# EasyEDA Pro project ProPrj_RGB_AddOn.epro, board PCB1
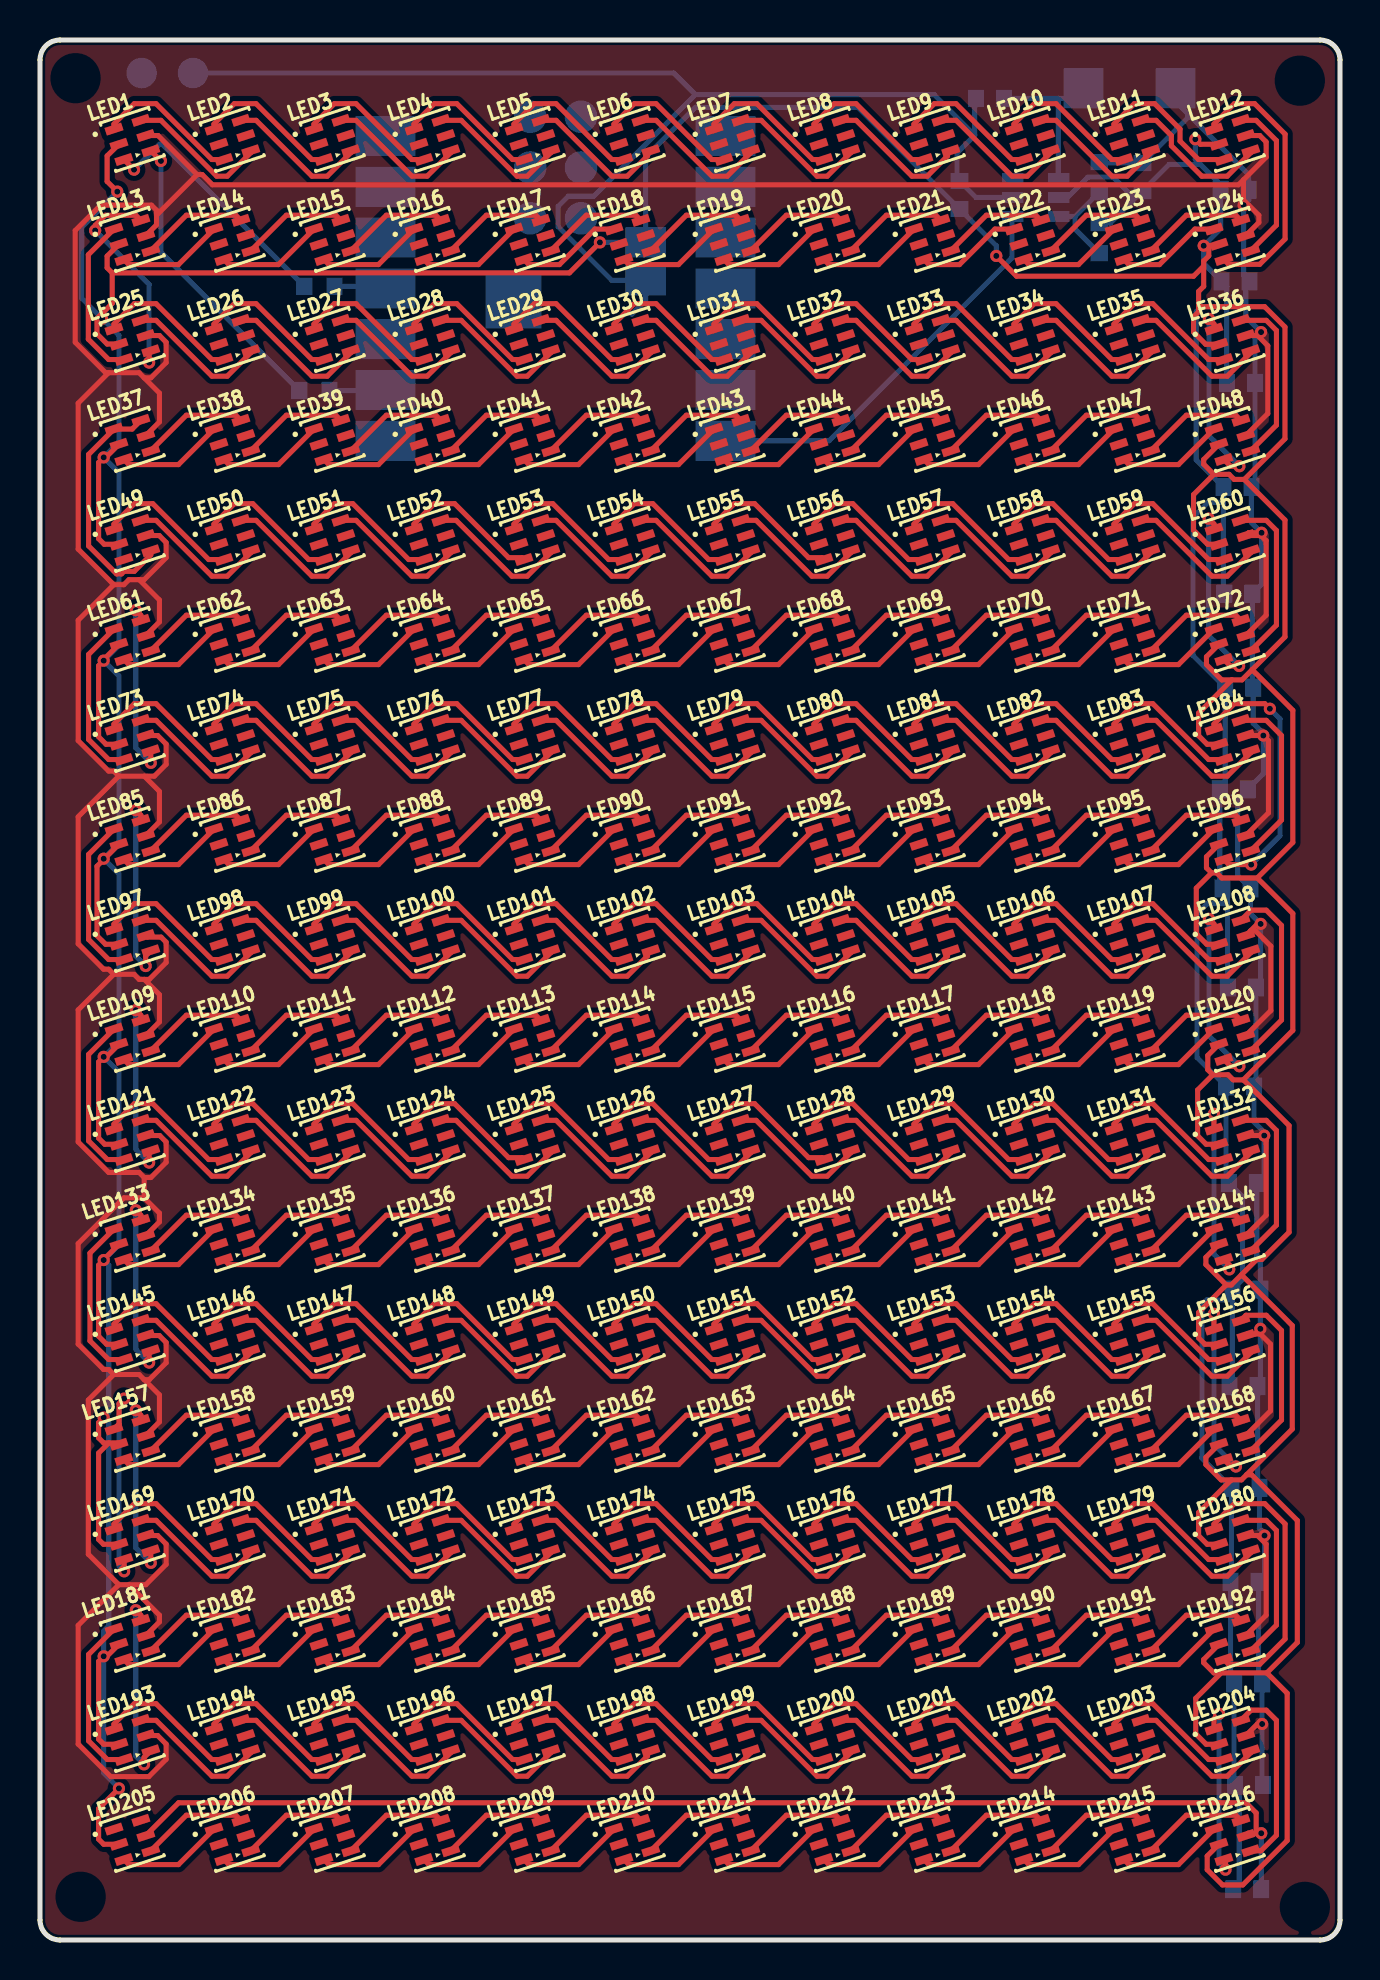
[diagram p2: board, top side]
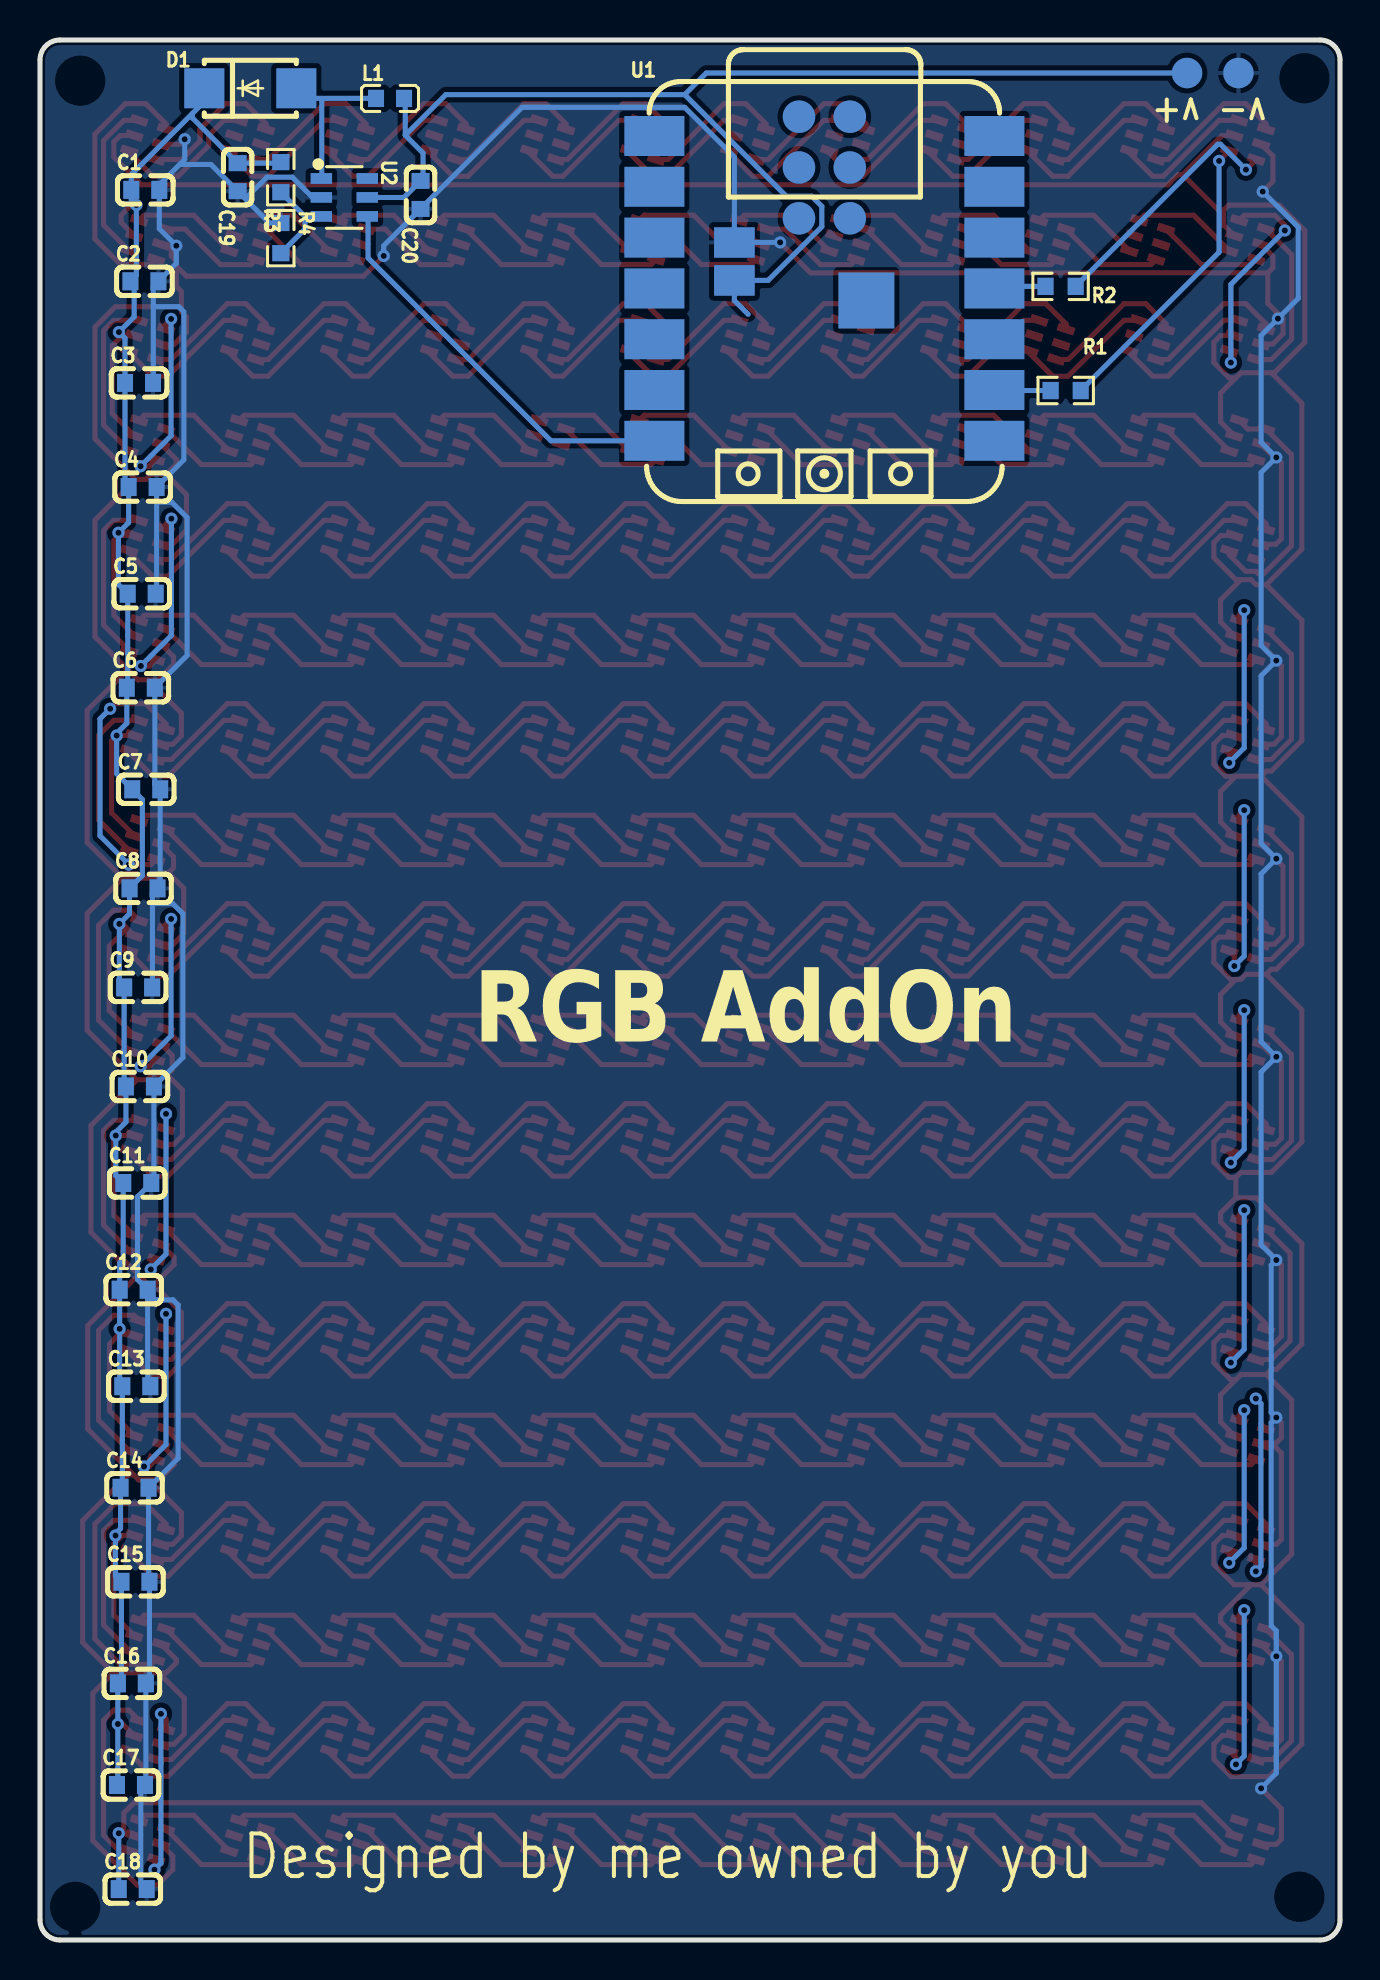
[diagram p3: board, bottom side, seen from below]

Outline 65 x 95 mm; copper layers: Top Layer, Bottom Layer. Coordinates in mm from the lower left corner of the outline.
Outline path: 0,94 0,1 arc(0.29,0.29) 1,0 64,0 arc(64.71,0.29) 65,1 65,94 arc(64.71,94.71) 64,95 1,95 arc(0.29,94.71) 0,94
Stack: Top Layer 0.035mm / Dielectric1 0.71mm FR4 er 4.5 / Bottom Layer 0.035mm

## Design rules (mm)
template: JLCPCB Capability(Two Layers Board)
spacing copperThickness1oz (default): track to track 0.102, other pairs 0.152 to 0.3
spacing copperThickness2oz: track to track 0.203, other pairs 0.152 to 0.3
track width copperThickness1oz (default): min 0.127, default 0.254, max 2.54
track width copperThickness2oz: min 0.203, default 0.254, max 2.54
differential pair differentialPair (default): width min 0.127, default 0.254, max 2.54; gap min 0.152, default 0.152
via viaSize (default): diameter min 0.5, default 0.61, max 10; hole min 0.3, default 0.305, max 6.3

## Placement (name value [footprint] x y rotation side)
C1  100nF  [C0603]  59.74 87.51 180 bottom
C2  100nF  [C0603]  59.78 82.93 180 bottom
C3  100nF  [C0603]  60.05 77.85 180 bottom
C4  100nF  [C0603]  59.87 72.65 180 bottom
C5  100nF  [C0603]  59.91 67.31 180 bottom
C6  100nF  [C0603]  59.96 62.61 180 bottom
C7  100nF  [C0603]  59.69 57.53 180 bottom
C8  100nF  [C0603]  59.82 52.58 180 bottom
C9  100nF  [C0603]  60.09 47.63 180 bottom
C10  100nF  [C0603]  60 42.68 180 bottom
C11  100nF  [C0603]  60.14 37.85 180 bottom
C12  100nF  [C0603]  60.32 32.52 180 bottom
C13  100nF  [C0603]  60.18 27.69 180 bottom
C14  100nF  [C0603]  60.27 22.61 180 bottom
C15  100nF  [C0603]  60.23 17.91 180 bottom
C16  100nF  [C0603]  60.41 12.83 180 bottom
C17  100nF  [C0603]  60.45 7.75 180 bottom
C18  100nF  [C0603]  60.36 2.54 180 bottom
C19  220uf  [C0603]  55.12 88.14 90 bottom
C20  22uF  [C0603]  45.97 87.25 90 bottom
D1  SS24  [DO-214AC_L4.3-W2.7-LS5.2-RD]  54.48 92.59 180 bottom
L1  4.7uH  [L0603]  47.5 92.08 180 bottom
LED1  SK9822-EC20  [LED-SMD_6P-L2.0-W2.0-P0.80-TL]  4.62 90 18 top
LED2  SK9822-EC20  [LED-SMD_6P-L2.0-W2.0-P0.80-TL]  9.62 90 18 top
LED3  SK9822-EC20  [LED-SMD_6P-L2.0-W2.0-P0.80-TL]  14.62 90 18 top
LED4  SK9822-EC20  [LED-SMD_6P-L2.0-W2.0-P0.80-TL]  19.62 90 18 top
LED5  SK9822-EC20  [LED-SMD_6P-L2.0-W2.0-P0.80-TL]  24.62 90 18 top
LED6  SK9822-EC20  [LED-SMD_6P-L2.0-W2.0-P0.80-TL]  29.62 90 18 top
LED7  SK9822-EC20  [LED-SMD_6P-L2.0-W2.0-P0.80-TL]  34.62 90 18 top
LED8  SK9822-EC20  [LED-SMD_6P-L2.0-W2.0-P0.80-TL]  39.62 90 18 top
LED9  SK9822-EC20  [LED-SMD_6P-L2.0-W2.0-P0.80-TL]  44.62 90 18 top
LED10  SK9822-EC20  [LED-SMD_6P-L2.0-W2.0-P0.80-TL]  49.62 90 18 top
LED11  SK9822-EC20  [LED-SMD_6P-L2.0-W2.0-P0.80-TL]  54.62 90 18 top
LED12  SK9822-EC20  [LED-SMD_6P-L2.0-W2.0-P0.80-TL]  59.62 90 18 top
LED13  SK9822-EC20  [LED-SMD_6P-L2.0-W2.0-P0.80-TL]  4.62 85 18 top
LED14  SK9822-EC20  [LED-SMD_6P-L2.0-W2.0-P0.80-TL]  9.62 85 18 top
LED15  SK9822-EC20  [LED-SMD_6P-L2.0-W2.0-P0.80-TL]  14.62 85 18 top
LED16  SK9822-EC20  [LED-SMD_6P-L2.0-W2.0-P0.80-TL]  19.62 85 18 top
LED17  SK9822-EC20  [LED-SMD_6P-L2.0-W2.0-P0.80-TL]  24.62 85 18 top
LED18  SK9822-EC20  [LED-SMD_6P-L2.0-W2.0-P0.80-TL]  29.62 85 18 top
LED19  SK9822-EC20  [LED-SMD_6P-L2.0-W2.0-P0.80-TL]  34.62 85 18 top
LED20  SK9822-EC20  [LED-SMD_6P-L2.0-W2.0-P0.80-TL]  39.62 85 18 top
LED21  SK9822-EC20  [LED-SMD_6P-L2.0-W2.0-P0.80-TL]  44.62 85 18 top
LED22  SK9822-EC20  [LED-SMD_6P-L2.0-W2.0-P0.80-TL]  49.62 85 18 top
LED23  SK9822-EC20  [LED-SMD_6P-L2.0-W2.0-P0.80-TL]  54.62 85 18 top
LED24  SK9822-EC20  [LED-SMD_6P-L2.0-W2.0-P0.80-TL]  59.62 85 18 top
LED25  SK9822-EC20  [LED-SMD_6P-L2.0-W2.0-P0.80-TL]  4.62 80 18 top
LED26  SK9822-EC20  [LED-SMD_6P-L2.0-W2.0-P0.80-TL]  9.62 80 18 top
LED27  SK9822-EC20  [LED-SMD_6P-L2.0-W2.0-P0.80-TL]  14.62 80 18 top
LED28  SK9822-EC20  [LED-SMD_6P-L2.0-W2.0-P0.80-TL]  19.62 80 18 top
LED29  SK9822-EC20  [LED-SMD_6P-L2.0-W2.0-P0.80-TL]  24.62 80 18 top
LED30  SK9822-EC20  [LED-SMD_6P-L2.0-W2.0-P0.80-TL]  29.62 80 18 top
LED31  SK9822-EC20  [LED-SMD_6P-L2.0-W2.0-P0.80-TL]  34.62 80 18 top
LED32  SK9822-EC20  [LED-SMD_6P-L2.0-W2.0-P0.80-TL]  39.62 80 18 top
LED33  SK9822-EC20  [LED-SMD_6P-L2.0-W2.0-P0.80-TL]  44.62 80 18 top
LED34  SK9822-EC20  [LED-SMD_6P-L2.0-W2.0-P0.80-TL]  49.62 80 18 top
LED35  SK9822-EC20  [LED-SMD_6P-L2.0-W2.0-P0.80-TL]  54.62 80 18 top
LED36  SK9822-EC20  [LED-SMD_6P-L2.0-W2.0-P0.80-TL]  59.62 80 18 top
LED37  SK9822-EC20  [LED-SMD_6P-L2.0-W2.0-P0.80-TL]  4.62 75 18 top
LED38  SK9822-EC20  [LED-SMD_6P-L2.0-W2.0-P0.80-TL]  9.62 75 18 top
LED39  SK9822-EC20  [LED-SMD_6P-L2.0-W2.0-P0.80-TL]  14.62 75 18 top
LED40  SK9822-EC20  [LED-SMD_6P-L2.0-W2.0-P0.80-TL]  19.62 75 18 top
LED41  SK9822-EC20  [LED-SMD_6P-L2.0-W2.0-P0.80-TL]  24.62 75 18 top
LED42  SK9822-EC20  [LED-SMD_6P-L2.0-W2.0-P0.80-TL]  29.62 75 18 top
LED43  SK9822-EC20  [LED-SMD_6P-L2.0-W2.0-P0.80-TL]  34.62 75 18 top
LED44  SK9822-EC20  [LED-SMD_6P-L2.0-W2.0-P0.80-TL]  39.62 75 18 top
LED45  SK9822-EC20  [LED-SMD_6P-L2.0-W2.0-P0.80-TL]  44.62 75 18 top
LED46  SK9822-EC20  [LED-SMD_6P-L2.0-W2.0-P0.80-TL]  49.62 75 18 top
LED47  SK9822-EC20  [LED-SMD_6P-L2.0-W2.0-P0.80-TL]  54.62 75 18 top
LED48  SK9822-EC20  [LED-SMD_6P-L2.0-W2.0-P0.80-TL]  59.62 75 18 top
LED49  SK9822-EC20  [LED-SMD_6P-L2.0-W2.0-P0.80-TL]  4.62 70 18 top
LED50  SK9822-EC20  [LED-SMD_6P-L2.0-W2.0-P0.80-TL]  9.62 70 18 top
LED51  SK9822-EC20  [LED-SMD_6P-L2.0-W2.0-P0.80-TL]  14.62 70 18 top
LED52  SK9822-EC20  [LED-SMD_6P-L2.0-W2.0-P0.80-TL]  19.62 70 18 top
LED53  SK9822-EC20  [LED-SMD_6P-L2.0-W2.0-P0.80-TL]  24.62 70 18 top
LED54  SK9822-EC20  [LED-SMD_6P-L2.0-W2.0-P0.80-TL]  29.62 70 18 top
LED55  SK9822-EC20  [LED-SMD_6P-L2.0-W2.0-P0.80-TL]  34.62 70 18 top
LED56  SK9822-EC20  [LED-SMD_6P-L2.0-W2.0-P0.80-TL]  39.62 70 18 top
LED57  SK9822-EC20  [LED-SMD_6P-L2.0-W2.0-P0.80-TL]  44.62 70 18 top
LED58  SK9822-EC20  [LED-SMD_6P-L2.0-W2.0-P0.80-TL]  49.62 70 18 top
LED59  SK9822-EC20  [LED-SMD_6P-L2.0-W2.0-P0.80-TL]  54.62 70 18 top
LED60  SK9822-EC20  [LED-SMD_6P-L2.0-W2.0-P0.80-TL]  59.62 70 18 top
LED61  SK9822-EC20  [LED-SMD_6P-L2.0-W2.0-P0.80-TL]  4.62 65 18 top
LED62  SK9822-EC20  [LED-SMD_6P-L2.0-W2.0-P0.80-TL]  9.62 65 18 top
LED63  SK9822-EC20  [LED-SMD_6P-L2.0-W2.0-P0.80-TL]  14.62 65 18 top
LED64  SK9822-EC20  [LED-SMD_6P-L2.0-W2.0-P0.80-TL]  19.62 65 18 top
LED65  SK9822-EC20  [LED-SMD_6P-L2.0-W2.0-P0.80-TL]  24.62 65 18 top
LED66  SK9822-EC20  [LED-SMD_6P-L2.0-W2.0-P0.80-TL]  29.62 65 18 top
LED67  SK9822-EC20  [LED-SMD_6P-L2.0-W2.0-P0.80-TL]  34.62 65 18 top
LED68  SK9822-EC20  [LED-SMD_6P-L2.0-W2.0-P0.80-TL]  39.62 65 18 top
LED69  SK9822-EC20  [LED-SMD_6P-L2.0-W2.0-P0.80-TL]  44.62 65 18 top
LED70  SK9822-EC20  [LED-SMD_6P-L2.0-W2.0-P0.80-TL]  49.62 65 18 top
LED71  SK9822-EC20  [LED-SMD_6P-L2.0-W2.0-P0.80-TL]  54.62 65 18 top
LED72  SK9822-EC20  [LED-SMD_6P-L2.0-W2.0-P0.80-TL]  59.62 65 18 top
LED73  SK9822-EC20  [LED-SMD_6P-L2.0-W2.0-P0.80-TL]  4.62 60 18 top
LED74  SK9822-EC20  [LED-SMD_6P-L2.0-W2.0-P0.80-TL]  9.62 60 18 top
LED75  SK9822-EC20  [LED-SMD_6P-L2.0-W2.0-P0.80-TL]  14.62 60 18 top
LED76  SK9822-EC20  [LED-SMD_6P-L2.0-W2.0-P0.80-TL]  19.62 60 18 top
LED77  SK9822-EC20  [LED-SMD_6P-L2.0-W2.0-P0.80-TL]  24.62 60 18 top
LED78  SK9822-EC20  [LED-SMD_6P-L2.0-W2.0-P0.80-TL]  29.62 60 18 top
LED79  SK9822-EC20  [LED-SMD_6P-L2.0-W2.0-P0.80-TL]  34.62 60 18 top
LED80  SK9822-EC20  [LED-SMD_6P-L2.0-W2.0-P0.80-TL]  39.62 60 18 top
LED81  SK9822-EC20  [LED-SMD_6P-L2.0-W2.0-P0.80-TL]  44.62 60 18 top
LED82  SK9822-EC20  [LED-SMD_6P-L2.0-W2.0-P0.80-TL]  49.62 60 18 top
LED83  SK9822-EC20  [LED-SMD_6P-L2.0-W2.0-P0.80-TL]  54.62 60 18 top
LED84  SK9822-EC20  [LED-SMD_6P-L2.0-W2.0-P0.80-TL]  59.62 60 18 top
LED85  SK9822-EC20  [LED-SMD_6P-L2.0-W2.0-P0.80-TL]  4.62 55 18 top
LED86  SK9822-EC20  [LED-SMD_6P-L2.0-W2.0-P0.80-TL]  9.62 55 18 top
LED87  SK9822-EC20  [LED-SMD_6P-L2.0-W2.0-P0.80-TL]  14.62 55 18 top
LED88  SK9822-EC20  [LED-SMD_6P-L2.0-W2.0-P0.80-TL]  19.62 55 18 top
LED89  SK9822-EC20  [LED-SMD_6P-L2.0-W2.0-P0.80-TL]  24.62 55 18 top
LED90  SK9822-EC20  [LED-SMD_6P-L2.0-W2.0-P0.80-TL]  29.62 55 18 top
LED91  SK9822-EC20  [LED-SMD_6P-L2.0-W2.0-P0.80-TL]  34.62 55 18 top
LED92  SK9822-EC20  [LED-SMD_6P-L2.0-W2.0-P0.80-TL]  39.62 55 18 top
LED93  SK9822-EC20  [LED-SMD_6P-L2.0-W2.0-P0.80-TL]  44.62 55 18 top
LED94  SK9822-EC20  [LED-SMD_6P-L2.0-W2.0-P0.80-TL]  49.62 55 18 top
LED95  SK9822-EC20  [LED-SMD_6P-L2.0-W2.0-P0.80-TL]  54.62 55 18 top
LED96  SK9822-EC20  [LED-SMD_6P-L2.0-W2.0-P0.80-TL]  59.62 55 18 top
LED97  SK9822-EC20  [LED-SMD_6P-L2.0-W2.0-P0.80-TL]  4.62 50 18 top
LED98  SK9822-EC20  [LED-SMD_6P-L2.0-W2.0-P0.80-TL]  9.62 50 18 top
LED99  SK9822-EC20  [LED-SMD_6P-L2.0-W2.0-P0.80-TL]  14.62 50 18 top
LED100  SK9822-EC20  [LED-SMD_6P-L2.0-W2.0-P0.80-TL]  19.62 50 18 top
LED101  SK9822-EC20  [LED-SMD_6P-L2.0-W2.0-P0.80-TL]  24.62 50 18 top
LED102  SK9822-EC20  [LED-SMD_6P-L2.0-W2.0-P0.80-TL]  29.62 50 18 top
LED103  SK9822-EC20  [LED-SMD_6P-L2.0-W2.0-P0.80-TL]  34.62 50 18 top
LED104  SK9822-EC20  [LED-SMD_6P-L2.0-W2.0-P0.80-TL]  39.62 50 18 top
LED105  SK9822-EC20  [LED-SMD_6P-L2.0-W2.0-P0.80-TL]  44.62 50 18 top
LED106  SK9822-EC20  [LED-SMD_6P-L2.0-W2.0-P0.80-TL]  49.62 50 18 top
LED107  SK9822-EC20  [LED-SMD_6P-L2.0-W2.0-P0.80-TL]  54.62 50 18 top
LED108  SK9822-EC20  [LED-SMD_6P-L2.0-W2.0-P0.80-TL]  59.62 50 18 top
LED109  SK9822-EC20  [LED-SMD_6P-L2.0-W2.0-P0.80-TL]  4.62 45 18 top
LED110  SK9822-EC20  [LED-SMD_6P-L2.0-W2.0-P0.80-TL]  9.62 45 18 top
LED111  SK9822-EC20  [LED-SMD_6P-L2.0-W2.0-P0.80-TL]  14.62 45 18 top
LED112  SK9822-EC20  [LED-SMD_6P-L2.0-W2.0-P0.80-TL]  19.62 45 18 top
LED113  SK9822-EC20  [LED-SMD_6P-L2.0-W2.0-P0.80-TL]  24.62 45 18 top
LED114  SK9822-EC20  [LED-SMD_6P-L2.0-W2.0-P0.80-TL]  29.62 45 18 top
LED115  SK9822-EC20  [LED-SMD_6P-L2.0-W2.0-P0.80-TL]  34.62 45 18 top
LED116  SK9822-EC20  [LED-SMD_6P-L2.0-W2.0-P0.80-TL]  39.62 45 18 top
LED117  SK9822-EC20  [LED-SMD_6P-L2.0-W2.0-P0.80-TL]  44.62 45 18 top
LED118  SK9822-EC20  [LED-SMD_6P-L2.0-W2.0-P0.80-TL]  49.62 45 18 top
LED119  SK9822-EC20  [LED-SMD_6P-L2.0-W2.0-P0.80-TL]  54.62 45 18 top
LED120  SK9822-EC20  [LED-SMD_6P-L2.0-W2.0-P0.80-TL]  59.62 45 18 top
LED121  SK9822-EC20  [LED-SMD_6P-L2.0-W2.0-P0.80-TL]  4.62 40 18 top
LED122  SK9822-EC20  [LED-SMD_6P-L2.0-W2.0-P0.80-TL]  9.62 40 18 top
LED123  SK9822-EC20  [LED-SMD_6P-L2.0-W2.0-P0.80-TL]  14.62 40 18 top
LED124  SK9822-EC20  [LED-SMD_6P-L2.0-W2.0-P0.80-TL]  19.62 40 18 top
LED125  SK9822-EC20  [LED-SMD_6P-L2.0-W2.0-P0.80-TL]  24.62 40 18 top
LED126  SK9822-EC20  [LED-SMD_6P-L2.0-W2.0-P0.80-TL]  29.62 40 18 top
LED127  SK9822-EC20  [LED-SMD_6P-L2.0-W2.0-P0.80-TL]  34.62 40 18 top
LED128  SK9822-EC20  [LED-SMD_6P-L2.0-W2.0-P0.80-TL]  39.62 40 18 top
LED129  SK9822-EC20  [LED-SMD_6P-L2.0-W2.0-P0.80-TL]  44.62 40 18 top
LED130  SK9822-EC20  [LED-SMD_6P-L2.0-W2.0-P0.80-TL]  49.62 40 18 top
LED131  SK9822-EC20  [LED-SMD_6P-L2.0-W2.0-P0.80-TL]  54.62 40 18 top
LED132  SK9822-EC20  [LED-SMD_6P-L2.0-W2.0-P0.80-TL]  59.62 40 18 top
LED133  SK9822-EC20  [LED-SMD_6P-L2.0-W2.0-P0.80-TL]  4.62 35 18 top
LED134  SK9822-EC20  [LED-SMD_6P-L2.0-W2.0-P0.80-TL]  9.62 35 18 top
LED135  SK9822-EC20  [LED-SMD_6P-L2.0-W2.0-P0.80-TL]  14.62 35 18 top
LED136  SK9822-EC20  [LED-SMD_6P-L2.0-W2.0-P0.80-TL]  19.62 35 18 top
LED137  SK9822-EC20  [LED-SMD_6P-L2.0-W2.0-P0.80-TL]  24.62 35 18 top
LED138  SK9822-EC20  [LED-SMD_6P-L2.0-W2.0-P0.80-TL]  29.62 35 18 top
LED139  SK9822-EC20  [LED-SMD_6P-L2.0-W2.0-P0.80-TL]  34.62 35 18 top
LED140  SK9822-EC20  [LED-SMD_6P-L2.0-W2.0-P0.80-TL]  39.62 35 18 top
LED141  SK9822-EC20  [LED-SMD_6P-L2.0-W2.0-P0.80-TL]  44.62 35 18 top
LED142  SK9822-EC20  [LED-SMD_6P-L2.0-W2.0-P0.80-TL]  49.62 35 18 top
LED143  SK9822-EC20  [LED-SMD_6P-L2.0-W2.0-P0.80-TL]  54.62 35 18 top
LED144  SK9822-EC20  [LED-SMD_6P-L2.0-W2.0-P0.80-TL]  59.62 35 18 top
LED145  SK9822-EC20  [LED-SMD_6P-L2.0-W2.0-P0.80-TL]  4.62 30 18 top
LED146  SK9822-EC20  [LED-SMD_6P-L2.0-W2.0-P0.80-TL]  9.62 30 18 top
LED147  SK9822-EC20  [LED-SMD_6P-L2.0-W2.0-P0.80-TL]  14.62 30 18 top
LED148  SK9822-EC20  [LED-SMD_6P-L2.0-W2.0-P0.80-TL]  19.62 30 18 top
LED149  SK9822-EC20  [LED-SMD_6P-L2.0-W2.0-P0.80-TL]  24.62 30 18 top
LED150  SK9822-EC20  [LED-SMD_6P-L2.0-W2.0-P0.80-TL]  29.62 30 18 top
LED151  SK9822-EC20  [LED-SMD_6P-L2.0-W2.0-P0.80-TL]  34.62 30 18 top
LED152  SK9822-EC20  [LED-SMD_6P-L2.0-W2.0-P0.80-TL]  39.62 30 18 top
LED153  SK9822-EC20  [LED-SMD_6P-L2.0-W2.0-P0.80-TL]  44.62 30 18 top
LED154  SK9822-EC20  [LED-SMD_6P-L2.0-W2.0-P0.80-TL]  49.62 30 18 top
LED155  SK9822-EC20  [LED-SMD_6P-L2.0-W2.0-P0.80-TL]  54.62 30 18 top
LED156  SK9822-EC20  [LED-SMD_6P-L2.0-W2.0-P0.80-TL]  59.62 30 18 top
LED157  SK9822-EC20  [LED-SMD_6P-L2.0-W2.0-P0.80-TL]  4.62 25 18 top
LED158  SK9822-EC20  [LED-SMD_6P-L2.0-W2.0-P0.80-TL]  9.62 25 18 top
LED159  SK9822-EC20  [LED-SMD_6P-L2.0-W2.0-P0.80-TL]  14.62 25 18 top
LED160  SK9822-EC20  [LED-SMD_6P-L2.0-W2.0-P0.80-TL]  19.62 25 18 top
LED161  SK9822-EC20  [LED-SMD_6P-L2.0-W2.0-P0.80-TL]  24.62 25 18 top
LED162  SK9822-EC20  [LED-SMD_6P-L2.0-W2.0-P0.80-TL]  29.62 25 18 top
LED163  SK9822-EC20  [LED-SMD_6P-L2.0-W2.0-P0.80-TL]  34.62 25 18 top
LED164  SK9822-EC20  [LED-SMD_6P-L2.0-W2.0-P0.80-TL]  39.62 25 18 top
LED165  SK9822-EC20  [LED-SMD_6P-L2.0-W2.0-P0.80-TL]  44.62 25 18 top
LED166  SK9822-EC20  [LED-SMD_6P-L2.0-W2.0-P0.80-TL]  49.62 25 18 top
LED167  SK9822-EC20  [LED-SMD_6P-L2.0-W2.0-P0.80-TL]  54.62 25 18 top
LED168  SK9822-EC20  [LED-SMD_6P-L2.0-W2.0-P0.80-TL]  59.62 25 18 top
LED169  SK9822-EC20  [LED-SMD_6P-L2.0-W2.0-P0.80-TL]  4.62 20 18 top
LED170  SK9822-EC20  [LED-SMD_6P-L2.0-W2.0-P0.80-TL]  9.62 20 18 top
LED171  SK9822-EC20  [LED-SMD_6P-L2.0-W2.0-P0.80-TL]  14.62 20 18 top
LED172  SK9822-EC20  [LED-SMD_6P-L2.0-W2.0-P0.80-TL]  19.62 20 18 top
LED173  SK9822-EC20  [LED-SMD_6P-L2.0-W2.0-P0.80-TL]  24.62 20 18 top
LED174  SK9822-EC20  [LED-SMD_6P-L2.0-W2.0-P0.80-TL]  29.62 20 18 top
LED175  SK9822-EC20  [LED-SMD_6P-L2.0-W2.0-P0.80-TL]  34.62 20 18 top
LED176  SK9822-EC20  [LED-SMD_6P-L2.0-W2.0-P0.80-TL]  39.62 20 18 top
LED177  SK9822-EC20  [LED-SMD_6P-L2.0-W2.0-P0.80-TL]  44.62 20 18 top
LED178  SK9822-EC20  [LED-SMD_6P-L2.0-W2.0-P0.80-TL]  49.62 20 18 top
LED179  SK9822-EC20  [LED-SMD_6P-L2.0-W2.0-P0.80-TL]  54.62 20 18 top
LED180  SK9822-EC20  [LED-SMD_6P-L2.0-W2.0-P0.80-TL]  59.62 20 18 top
LED181  SK9822-EC20  [LED-SMD_6P-L2.0-W2.0-P0.80-TL]  4.62 15 18 top
LED182  SK9822-EC20  [LED-SMD_6P-L2.0-W2.0-P0.80-TL]  9.62 15 18 top
LED183  SK9822-EC20  [LED-SMD_6P-L2.0-W2.0-P0.80-TL]  14.62 15 18 top
LED184  SK9822-EC20  [LED-SMD_6P-L2.0-W2.0-P0.80-TL]  19.62 15 18 top
LED185  SK9822-EC20  [LED-SMD_6P-L2.0-W2.0-P0.80-TL]  24.62 15 18 top
LED186  SK9822-EC20  [LED-SMD_6P-L2.0-W2.0-P0.80-TL]  29.62 15 18 top
LED187  SK9822-EC20  [LED-SMD_6P-L2.0-W2.0-P0.80-TL]  34.62 15 18 top
LED188  SK9822-EC20  [LED-SMD_6P-L2.0-W2.0-P0.80-TL]  39.62 15 18 top
LED189  SK9822-EC20  [LED-SMD_6P-L2.0-W2.0-P0.80-TL]  44.62 15 18 top
LED190  SK9822-EC20  [LED-SMD_6P-L2.0-W2.0-P0.80-TL]  49.62 15 18 top
LED191  SK9822-EC20  [LED-SMD_6P-L2.0-W2.0-P0.80-TL]  54.62 15 18 top
LED192  SK9822-EC20  [LED-SMD_6P-L2.0-W2.0-P0.80-TL]  59.62 15 18 top
LED193  SK9822-EC20  [LED-SMD_6P-L2.0-W2.0-P0.80-TL]  4.62 10 18 top
LED194  SK9822-EC20  [LED-SMD_6P-L2.0-W2.0-P0.80-TL]  9.62 10 18 top
LED195  SK9822-EC20  [LED-SMD_6P-L2.0-W2.0-P0.80-TL]  14.62 10 18 top
LED196  SK9822-EC20  [LED-SMD_6P-L2.0-W2.0-P0.80-TL]  19.62 10 18 top
LED197  SK9822-EC20  [LED-SMD_6P-L2.0-W2.0-P0.80-TL]  24.62 10 18 top
LED198  SK9822-EC20  [LED-SMD_6P-L2.0-W2.0-P0.80-TL]  29.62 10 18 top
LED199  SK9822-EC20  [LED-SMD_6P-L2.0-W2.0-P0.80-TL]  34.62 10 18 top
LED200  SK9822-EC20  [LED-SMD_6P-L2.0-W2.0-P0.80-TL]  39.62 10 18 top
LED201  SK9822-EC20  [LED-SMD_6P-L2.0-W2.0-P0.80-TL]  44.62 10 18 top
LED202  SK9822-EC20  [LED-SMD_6P-L2.0-W2.0-P0.80-TL]  49.62 10 18 top
LED203  SK9822-EC20  [LED-SMD_6P-L2.0-W2.0-P0.80-TL]  54.62 10 18 top
LED204  SK9822-EC20  [LED-SMD_6P-L2.0-W2.0-P0.80-TL]  59.62 10 18 top
LED205  SK9822-EC20  [LED-SMD_6P-L2.0-W2.0-P0.80-TL]  4.62 5 18 top
LED206  SK9822-EC20  [LED-SMD_6P-L2.0-W2.0-P0.80-TL]  9.62 5 18 top
LED207  SK9822-EC20  [LED-SMD_6P-L2.0-W2.0-P0.80-TL]  14.62 5 18 top
LED208  SK9822-EC20  [LED-SMD_6P-L2.0-W2.0-P0.80-TL]  19.62 5 18 top
LED209  SK9822-EC20  [LED-SMD_6P-L2.0-W2.0-P0.80-TL]  24.62 5 18 top
LED210  SK9822-EC20  [LED-SMD_6P-L2.0-W2.0-P0.80-TL]  29.62 5 18 top
LED211  SK9822-EC20  [LED-SMD_6P-L2.0-W2.0-P0.80-TL]  34.62 5 18 top
LED212  SK9822-EC20  [LED-SMD_6P-L2.0-W2.0-P0.80-TL]  39.62 5 18 top
LED213  SK9822-EC20  [LED-SMD_6P-L2.0-W2.0-P0.80-TL]  44.62 5 18 top
LED214  SK9822-EC20  [LED-SMD_6P-L2.0-W2.0-P0.80-TL]  49.62 5 18 top
LED215  SK9822-EC20  [LED-SMD_6P-L2.0-W2.0-P0.80-TL]  54.62 5 18 top
LED216  SK9822-EC20  [LED-SMD_6P-L2.0-W2.0-P0.80-TL]  59.62 5 18 top
NOREF  -  [Pad_e25558]  7.65 93.35 0 top
NOREF#2  -  [Pad_e25557]  5.08 93.35 0 top
R1  10K  [R0603]  13.72 77.47 0 bottom
R2  10K  [R0603]  13.97 82.68 0 bottom
R3  110K  [R0603]  52.96 88.14 90 bottom
R4  15K  [R0603]  52.96 85.09 270 bottom
U1  XIAO ESP32C3  [CONN-SMD_113991054]  25.78 83.06 180 bottom
U2  MT3608  [SOT-23-6_L2.9-W1.6-P0.95-LS2.8-BL]  49.78 87.13 270 bottom

## Footprints (pads in the part's own frame, mm; a bottom-side part is the same pattern mirrored in y, then rotated)
C0603
  rect 0.8x0.9 smd: 1(-0.7,0) 2(0.7,0)
CONN-SMD_113991054
  rect 3x2 smd: 1(-8.5,7.138) 2(-8.5,4.598) 3(-8.5,2.058) 4(-8.5,-0.482) 5(-8.5,-3.022) 6(-8.5,-5.562) 7(-8.5,-8.102) 8(8.5,-8.102) 9(8.5,-5.562) 10(8.5,-3.022) 11(8.5,-0.482) 12(8.5,2.058) 13(8.5,4.598) 14(8.5,7.138)
  rect 2.032x1.524 smd: 15(-4.5,-0.083) 16(-4.5,1.817)
  rect 2.8x2.8 smd: 17(2.1,-1.083)
  custom 1.625x1.625 smd: 18(1.27,3.022) 19(-1.27,3.022) 20(1.27,5.562) 21(-1.27,5.562) 22(1.27,8.102) 23(-1.27,8.102)
DO-214AC_L4.3-W2.7-LS5.2-RD
  rect 2x2 smd: 1(-2.3,0) 2(2.3,0)
L0603
  rect 0.8x0.864 smd: 1(-0.7,0) 2(0.7,0)
LED-SMD_6P-L2.0-W2.0-P0.80-TL
  rect 0.875x0.4 smd: 1(-0.707,0.8) 2(-0.707,0) 3(-0.707,-0.8) 4(0.707,-0.8) 5(0.707,0) 6(0.707,0.8)
Pad_e25557
  round 1.524 smd far side: 1(0,0)
Pad_e25558
  round 1.524 smd far side: 2(0,0)
R0603
  rect 0.806x0.864 smd: 1(-0.753,0) 2(0.753,0)
SOT-23-6_L2.9-W1.6-P0.95-LS2.8-BL
  rect 0.532x1.072 smd: 1(-0.95,-1.149) 2(0,-1.149) 3(0.95,-1.149) 4(0.95,1.149) 5(0,1.149) 6(-0.95,1.149)

## Nets
As in the schematic, except:
AGND: C1.2 C2.2 C3.2 C4.2 C5.2 C6.2 C7.2 C8.2 C9.2 C10.2 C11.2 C12.2 C13.2 C14.2 C15.2 C16.2 C17.2 C18.2 C19.1 C20.1 LED1.2 LED12.2 LED13.2 LED24.2 LED25.2 LED36.2 LED37.2 LED48.2 LED49.2 LED60.2 LED61.2 LED72.2 LED73.2 LED84.2 LED85.2 LED96.2 LED97.2 LED108.2 LED109.2 LED120.2 LED121.2 LED132.2 LED133.2 LED144.2 LED145.2 LED156.2 LED157.2 LED168.2 LED169.2 LED180.2 LED181.2 LED192.2 LED193.2 LED204.2 LED205.2 LED216.2 NOREF#2.1 R4.1 U1.16 U2.2
VBAT(3.7V): C20.2 L1.2 NOREF.2 U1.15 U2.5

Pads without a net: LED2 2 5; LED3 2 5; LED4 2 5; LED5 2 5; LED6 2 5; LED7 2 5; LED8 2 5; LED9 2 5; LED10 2 5; LED11 2 5; LED14 2 5; LED15 2 5; LED16 2 5; LED17 2 5; LED18 2 5; LED19 2 5; LED20 2 5; LED21 2 5; LED22 2 5; LED23 2 5; LED26 2 5; LED27 2 5; LED28 2 5; LED29 2 5; LED30 2 5; LED31 2 5; LED32 2 5; LED33 2 5; LED34 2 5; LED35 2 5; LED38 2 5; LED39 2 5; LED40 2 5; LED41 2 5; LED42 2 5; LED43 2 5; LED44 2 5; LED45 2 5; LED46 2 5; LED47 2 5; LED50 2 5; LED51 2 5; LED52 2 5; LED53 2 5; LED54 2 5; LED55 2 5; LED56 2 5; LED57 2 5; LED58 2 5; LED59 2 5; LED62 2 5; LED63 2 5; LED64 2 5; LED65 2 5; LED66 2 5; LED67 2 5; LED68 2 5; LED69 2 5; LED70 2 5; LED71 2 5; LED74 2 5; LED75 2 5; LED76 2 5; LED77 2 5; LED78 2 5; LED79 2 5; LED80 2 5; LED81 2 5; LED82 2 5; LED83 2 5; LED86 2 5; LED87 2 5; LED88 2 5; LED89 2 5; LED90 2 5; LED91 2 5; LED92 2 5; LED93 2 5; LED94 2 5; LED95 2 5; LED98 2 5; LED99 2 5; LED100 2 5; LED101 2 5; LED102 2 5; LED103 2 5; LED104 2 5; LED105 2 5; LED106 2 5; LED107 2 5; LED110 2 5; LED111 2 5; LED112 2 5; LED113 2 5; LED114 2 5; LED115 2 5; LED116 2 5; LED117 2 5; LED118 2 5; LED119 2 5; LED122 2 5; LED123 2 5; LED124 2 5; LED125 2 5; LED126 2 5; LED127 2 5; LED128 2 5; LED129 2 5; LED130 2 5; LED131 2 5; LED134 2 5; LED135 2 5; LED136 2 5; LED137 2 5; LED138 2 5; LED139 2 5; LED140 2 5; LED141 2 5; LED142 2 5; LED143 2 5; LED146 2 5; LED147 2 5; LED148 2 5; LED149 2 5; LED150 2 5; LED151 2 5; LED152 2 5; LED153 2 5; LED154 2 5; LED155 2 5; LED158 2 5; LED159 2 5; LED160 2 5; LED161 2 5; LED162 2 5; LED163 2 5; LED164 2 5; LED165 2 5; LED166 2 5; LED167 2 5; LED170 2 5; LED171 2 5; LED172 2 5; LED173 2 5; LED174 2 5; LED175 2 5; LED176 2 5; LED177 2 5; LED178 2 5; LED179 2 5; LED182 2 5; LED183 2 5; LED184 2 5; LED185 2 5; LED186 2 5; LED187 2 5; LED188 2 5; LED189 2 5; LED190 2 5; LED191 2 5; LED194 2 5; LED195 2 5; LED196 2 5; LED197 2 5; LED198 2 5; LED199 2 5; LED200 2 5; LED201 2 5; LED202 2 5; LED203 2 5; LED205 1 6; LED206 2 5; LED207 2 5; LED208 2 5; LED209 2 5; LED210 2 5; LED211 2 5; LED212 2 5; LED213 2 5; LED214 2 5; LED215 2 5; U1 1 2 3 4 5 6 8 10 12 13 14 17 18 19 20 21 22 23; U2 6

## Via types
v1: diameter 0.61, hole 0.305, Top Layer to Bottom Layer, 56 vias

## Routing (per net, layer and track width the routed paths; a pad name or vN(x,y) marks a point on that pad's centre or on a via; arc(x,y) is an arc through that point)
+5V: length 370.1
  Top Layer w0.254: LED24.5 60.94,85.87 60.94,86.24 60.44,86.74 v1(60.18,86.74) 60.18,88.01 ; 3.43,78.36 3.28,78.36 1.76,79.89 1.76,85.47 3.03,86.74 5.57,86.74 5.83,86.49 5.83,86.24 ; 3.43,78.36 4.96,78.36 5.21,78.11 ; 3.43,78.36 1.91,76.84 1.91,69.54 3.69,67.76 ; 5.83,86.24 5.83,85.76 LED13.5 ; 5.83,86.24 7.86,88.27 ; 61.05,40.22 LED132.5 ; 61.05,40.22 61.31,39.97 61.31,36.24 LED144.5 ; 61.05,40.22 v1(61.21,40.22) ; 60.52,50.46 LED108.5 ; 60.52,50.46 60.87,50.8 v1(61.03,50.8) ; 60.52,50.46 60.78,50.46 61.54,49.69 61.54,46.47 LED120.5 ; 5.21,28.02 5.46,28.02 6.31,28.86 6.31,29.88 5.96,30.22 LED145.5 ; 5.21,28.02 4.96,28.27 3.69,28.27 ; 5.21,28.02 5.97,27.26 5.97,25.9 LED157.5 ; 3.94,17.76 2.42,19.29 2.42,27 3.69,28.27 ; 3.94,17.76 1.91,15.73 1.91,9.8 3.53,8.17 5.44,8.17 6.31,9.03 6.31,9.8 5.88,10.22 LED193.5 ; 3.94,17.76 4.45,17.76 ; 5.21,58.19 5.97,57.43 5.97,55.9 LED85.5 ; 5.21,58.19 3.94,58.19 ; 5.21,58.19 5.72,58.19 6.31,58.78 6.31,59.8 5.88,60.22 LED73.5 ; 3.69,28.27 3.43,28.53 3.18,28.53 1.91,29.8 1.91,34.82 4.19,37.11 5.21,37.11 ; 3.69,67.76 1.91,65.99 1.91,59.97 3.43,58.44 3.69,58.44 3.94,58.19 ; 3.69,67.76 4.19,67.76 4.45,68.02 4.96,68.02 ; LED156.5 60.37,30.3 60.76,30.3 ; 7.86,88.27 5.9,90.22 LED1.5 ; 7.86,88.27 8.11,88.27 8.62,87.76 59.93,87.76 60.18,88.01 ; 3.94,58.19 1.91,56.16 1.91,49.81 3.18,48.54 3.43,48.54 3.69,48.28 ; 4.96,68.02 5.97,67 5.97,65.9 LED61.5 ; 4.96,68.02 5.21,68.02 6.31,69.12 6.31,69.88 5.96,70.22 LED49.5 ; 60.18,88.01 61.31,89.14 61.31,89.9 60.99,90.22 LED12.5 ; 60.88,20.22 LED180.5 ; 60.88,20.22 61.31,19.79 61.31,16.24 LED192.5 ; 60.88,20.22 v1(61.23,20.22) ; v1(61.02,30.56) 60.76,30.3 ; 60.76,30.3 61.02,30.3 61.53,29.8 61.53,26.46 LED168.5 ; 3.69,48.28 1.91,46.51 1.91,39.9 3.43,38.38 4.96,38.38 5.21,38.12 ; 3.69,48.28 4.7,48.28 4.96,48.03 5.21,48.03 ; LED133.5 5.97,35.9 5.97,36.35 5.21,37.11 ; 5.21,78.11 5.55,78.11 6.31,78.87 6.31,79.89 5.97,80.22 LED25.5 ; 5.21,78.11 5.97,77.35 5.97,75.9 LED37.5 ; LED72.5 61.31,66.24 61.31,69.97 61.05,70.22 LED60.5 60.43,70.36 v1(61.08,70.36) ; 5.21,38.12 5.55,38.12 6.31,38.89 6.31,39.9 5.99,40.22 LED121.5 ; 5.21,38.12 5.21,37.11 ; 60.88,80.22 61.39,79.71 61.39,76.32 LED48.5 ; 60.88,80.22 LED36.5 ; 60.88,80.22 v1(61.05,80.39) ; 5.21,48.03 5.46,48.03 6.31,48.87 6.31,49.89 6.05,50.14 5.37,50.14 LED97.5 ; 5.21,48.03 5.97,47.27 5.97,45.9 LED109.5 ; LED84.5 v1(61.17,60.22) 61.42,59.97 61.42,56.35 LED96.5 ; 4.45,17.76 5.29,17.76 6.31,18.78 6.31,19.8 5.88,20.22 LED169.5 ; 4.45,17.76 5.97,16.24 5.97,15.9 LED181.5 ; v1(61.11,10.8) 60.87,10.8 LED204.5
  Bottom Layer w0.254: 57.39,91.32 60.44,88.27 C1.1 60.44,87 v1(60.18,86.74) 60.18,83.23 C2.1 60.29,82.75 60.29,81.16 v1(61.05,80.39) 60.75,80.09 C3.1 60.75,72.83 C4.1 60.57,70.87 v1(61.08,70.36) 61.08,67.78 60.61,67.31 60.61,62.66 C6.1 60.66,60.84 61.17,60.33 v1(61.17,60.22) 61.17,58.31 C7.1 59.88,57.03 59.88,53.22 C8.1 60.52,51.31 v1(61.03,50.8) 61.03,47.87 C9.1 60.79,42.77 C10.1 60.7,40.9 61.21,40.39 v1(61.21,40.22) 61.21,38.22 C11.1 60.84,34.04 61.02,33.86 C12.1 v1(61.02,30.56) 61.02,27.82 C13.1 60.88,22.7 C14.1 60.97,20.58 61.23,20.32 v1(61.23,20.22) 61.23,18.21 C15.1 60.93,13.01 C16.1 v1(61.11,10.8) 61.11,7.8 C17.1 ; 57.39,91.32 56.78,91.92 D1.1 ; 57.39,91.32 57.39,91.11 C19.2 53.01,88.84 R3.2
AGND: length 502.5
  Top Layer w0.254: 3.61,83.36 3.36,83.61 3.36,84.2 LED13.2 ; 3.61,83.36 3.61,81.83 2.85,81.07 ; 3.61,83.36 26.47,83.36 v1(28,84.88) ; 3.44,24.85 2.93,24.35 2.93,20.03 3.17,19.79 LED169.2 ; 3.44,24.85 3.18,24.85 2.93,25.11 2.93,25.87 v1(3.18,26.12) ; 3.44,24.85 3.88,24.85 LED157.2 ; 61.34,13.36 59.06,13.36 ; 61.34,13.36 62.87,14.88 62.87,20.98 60.58,23.26 60.33,23.26 ; 61.34,13.36 62.36,12.34 62.36,4.97 60.14,2.75 59.12,2.75 58.36,3.52 58.36,4.2 LED216.2 ; 59.06,13.36 58.69,13.36 58.18,13.86 58.18,14.02 LED192.2 ; 59.06,13.36 57.79,12.09 57.79,10.31 58.31,9.79 LED204.2 ; LED84.2 58.36,59.79 57.93,60.21 57.93,61.34 59.59,63.01 ; LED60.2 58.38,69.79 57.68,70.49 57.68,72.27 58.69,73.28 ; LED181.2 3.35,14.19 v1(3.18,14.19) 2.93,13.93 2.93,10.04 3.18,9.79 LED193.2 ; LED145.2 3.33,29.79 2.93,30.19 2.93,33.74 v1(3.18,34) 3.18,34.02 LED133.2 ; v1(3.86,87.42) 3.36,87.93 3.36,89.21 LED1.2 ; 57.93,81.66 57.93,82.43 58.18,82.68 58.18,83.7 ; 57.93,81.66 57.93,81.41 57.68,81.16 57.68,80.39 58.29,79.79 LED36.2 ; 57.93,81.66 61.23,81.66 62.25,80.65 62.25,75.06 60.22,73.03 ; 60.17,43.01 62.45,40.72 62.45,35.39 61.09,34.02 60.84,34.02 60.07,33.26 ; 60.17,43.01 62.64,45.48 62.64,51.32 60.86,53.1 ; 60.17,43.01 59.66,43.01 59.41,43.26 58.64,43.26 ; 60.86,53.1 59.09,53.1 58.83,53.36 58.58,53.36 ; 60.86,53.1 62.64,54.88 62.64,61.48 60.61,63.52 ; 58.58,53.36 57.81,52.59 57.81,50.31 58.34,49.79 LED108.2 ; 58.58,53.36 58.32,53.61 58.32,54.16 LED96.2 ; LED132.2 58.31,39.79 57.88,40.21 57.88,42.5 58.64,43.26 ; 58.69,73.28 59.45,73.28 59.71,73.03 60.22,73.03 ; 58.69,73.28 58.18,73.79 58.18,74.02 LED48.2 ; 58.44,84.71 58.87,84.71 LED24.2 ; 58.44,84.71 v1(58.18,84.71) ; 58.44,84.71 58.44,84.2 58.18,83.95 58.18,83.7 ; v1(57.76,90.04) 58.02,89.79 LED12.2 ; 60.33,23.26 62.61,25.55 62.61,30.72 60.07,33.26 ; 60.33,23.26 60.07,23.01 59.56,23.01 ; 59.59,63.01 59.09,63.01 58.32,63.77 58.32,64.16 LED72.2 ; 59.59,63.01 60.1,63.01 60.61,63.52 ; 59.31,32.75 59.56,32.75 60.07,33.26 ; 59.31,32.75 58.29,33.77 58.29,34.13 LED144.2 ; 59.31,32.75 57.93,31.37 57.93,30.1 58.25,29.79 LED156.2 ; 58.64,43.26 58.39,43.52 58.39,44.23 LED120.2 ; LED85.2 3.22,54.06 ; 3.22,54.06 2.85,53.69 2.85,50.21 3.28,49.79 LED97.2 ; 3.22,54.06 v1(3.18,54.06) ; LED121.2 3.24,39.79 2.93,40.09 2.93,43.9 v1(3.18,44.16) 3.32,44.16 LED109.2 ; 2.85,81.07 v1(3.1,81.07) ; 2.85,81.07 2.85,80.31 3.36,79.8 3.93,79.8 LED25.2 ; 60.61,63.52 62.25,65.15 62.25,71 60.22,73.03 ; v1(47.81,84.2) 48.83,83.19 57.68,83.19 58.18,83.7 ; LED37.2 3.29,74.13 v1(3.18,74.13) 2.93,73.88 2.93,70.07 3.21,69.79 LED49.2 ; v1(3.95,7.58) 2.93,6.57 2.93,5.04 3.19,4.79 LED205.2 ; 59.56,23.01 59.06,23.01 58.29,23.77 58.29,24.13 LED168.2 ; 59.56,23.01 57.93,21.37 57.93,20.21 58.36,19.79 LED180.2 ; LED61.2 3.18,64.02 v1(3.18,63.97) 2.93,63.72 2.93,60.16 3.3,59.79 LED73.2
  Bottom Layer w0.254: 59.62,32.01 58.35,32.01 58.09,31.75 58.09,24.09 C14.2 59.57,17.96 59.53,17.91 59.53,13.01 C16.2 59.71,7.75 ; 59.62,32.01 C12.2 60.13,33.02 60.13,37.16 C11.2 59.3,37.98 C10.2 57.85,44.13 57.85,51.31 58.36,51.82 59.38,51.82 ; 59.62,32.01 59.62,27.82 C13.2 ; 59.38,51.82 59.38,52.33 C8.2 58.99,52.72 C7.2 59.26,57.8 C6.2 57.65,64.23 57.65,71.12 58.41,71.89 59.17,71.89 ; 59.38,51.82 59.38,47.64 C9.2 ; 58.02,88.78 56.45,88.78 C19.1 54.61,86.93 ; 58.02,88.78 57.76,89.03 v1(57.76,90.04) ; 58.02,88.78 59.03,87.76 C1.2 59.03,85.56 v1(58.18,84.71) 58.18,83.83 C2.2 59.33,82.68 59.33,81.66 ; C5.2 59.17,67.36 59.17,71.89 ; v1(28,84.88) U1.16 30.28,89.15 32.77,91.63 40.89,91.63 C20.1 47.81,84.71 v1(47.81,84.2) ; v1(3.86,87.42) 2.09,85.64 2.09,82.09 v1(3.1,81.07) 3.95,80.23 3.95,74.89 v1(3.18,74.13) 3.95,73.37 3.95,64.73 v1(3.18,63.97) 3.95,63.21 3.95,54.83 v1(3.18,54.06) 3.95,53.3 3.95,44.92 v1(3.18,44.16) 3.95,43.4 3.95,34.76 v1(3.18,34) 3.44,33.74 3.44,26.38 v1(3.18,26.12) 3.44,25.87 3.44,15.71 3.18,15.46 v1(3.18,14.19) 3.18,8.34 v1(3.95,7.58) ; 54.61,86.93 53.52,85.85 R4.1 ; 54.61,86.93 54.61,87.19 53.66,88.14 52.39,88.14 51.37,87.13 U2.2 ; 59.17,71.89 C4.2 57.81,74.01 57.81,81.41 58.06,81.66 59.33,81.66 ; 59.71,7.75 C17.2 ; 59.71,7.75 59.96,7.5 59.96,2.84 C18.2 ; 59.33,81.66 59.33,77.87 C3.2
VBAT(3.7V): length 65.6
  Bottom Layer w0.254: U2.5 46.8,87.13 45.85,88.08 45.85,89.35 46.74,90.24 ; 32.77,92.27 27.69,87.19 26.42,87.19 25.91,86.68 25.91,85.67 28.6,82.98 U1.15 30.28,81.97 29.59,81.28 ; 32.77,92.27 44.7,92.27 46.74,90.24 ; 32.77,92.27 31.69,93.35 NOREF.2 ; L1.2 46.74,92.02 46.74,90.24
CKL: length 2.8
  Bottom Layer w0.254: U1.9 17.26,77.47 R1.2
EN: length 20.2
  Bottom Layer w0.254: U2.4 48.59,86.14 48.59,84.1 39.45,74.96 U1.7
SDI: length 2.6
  Bottom Layer w0.254: U1.11 17.18,82.68 R2.2
$1N2153: length 7.2
  Top Layer w0.254: 55.04,10.98 55.81,10.98 58.6,8.19 59.36,8.19 60.54,9.37 LED204.4
$1N2157: length 7.2
  Top Layer w0.254: LED203.4 55.54,9.37 54.36,8.19 53.6,8.19 50.81,10.98 50.04,10.98
$1N2162: length 7.2
  Top Layer w0.254: 45.04,10.98 45.81,10.98 48.6,8.19 49.36,8.19 50.54,9.37 LED202.4
$1N2167: length 7.2
  Top Layer w0.254: LED201.4 45.38,9.3 45.38,9.21 44.36,8.19 43.6,8.19 40.81,10.98 40.04,10.98
$1N2172: length 7.2
  Top Layer w0.254: LED200.4 40.54,9.37 39.36,8.19 38.85,8.19 36.06,10.98 35.04,10.98
$1N2177: length 7.2
  Top Layer w0.254: LED199.4 35.54,9.37 34.36,8.19 33.6,8.19 30.81,10.98 30.04,10.98
$1N2182: length 7.2
  Top Layer w0.254: 25.04,10.98 25.81,10.98 28.6,8.19 29.36,8.19 30.38,9.21 30.38,9.3 LED198.4
$1N2187: length 7.2
  Top Layer w0.254: LED197.4 25.54,9.37 24.36,8.19 23.85,8.19 21.06,10.98 20.04,10.98
$1N2192: length 7.2
  Top Layer w0.254: 15.04,10.98 15.81,10.98 18.6,8.19 19.36,8.19 20.54,9.37 LED196.4
$1N2197: length 7.2
  Top Layer w0.254: LED194.6 10.81,10.98 13.6,8.19 14.36,8.19 15.54,9.37 LED195.4
$1N2202: length 7.2
  Top Layer w0.254: LED194.4 10.54,9.37 9.36,8.19 8.6,8.19 5.81,10.98 5.04,10.98
$1N2207: length 7.3
  Top Layer w0.254: LED193.1 3.7,10.8 4.72,11.82 5.8,11.82 8.59,9.02 LED194.3
$1N2212: length 7.3
  Top Layer w0.254: LED194.1 8.7,10.8 9.72,11.82 10.8,11.82 13.59,9.02 14.19,9.02
$1N2217: length 7.3
  Top Layer w0.254: 19.19,9.02 18.59,9.02 15.8,11.82 14.72,11.82 13.7,10.8 LED195.1
$1N2222: length 7.3
  Top Layer w0.254: LED196.1 18.7,10.8 19.72,11.82 20.84,11.82 23.63,9.02 24.19,9.02
$1N2227: length 7.3
  Top Layer w0.254: LED197.1 23.7,10.8 24.72,11.82 25.8,11.82 28.59,9.02 29.19,9.02
$1N2232: length 7.3
  Top Layer w0.254: LED198.1 28.7,10.8 29.72,11.82 30.8,11.82 33.59,9.02 34.19,9.02
$1N2253: length 7.3
  Top Layer w0.254: 39.19,9.02 38.63,9.02 35.84,11.82 34.72,11.82 33.7,10.8 LED199.1
$1N2257: length 7.3
  Top Layer w0.254: LED200.1 38.7,10.8 39.72,11.82 40.8,11.82 43.59,9.02 44.19,9.02
$1N2262: length 7.3
  Top Layer w0.254: 49.19,9.02 48.59,9.02 45.8,11.82 44.72,11.82 43.7,10.8 LED201.1
$1N2267: length 7.3
  Top Layer w0.254: LED202.1 48.7,10.8 49.72,11.82 50.8,11.82 53.59,9.02 54.19,9.02
$1N2275: length 7.3
  Top Layer w0.254: 59.19,9.02 58.43,9.02 55.64,11.82 54.72,11.82 53.7,10.8 LED203.1
$1N2916: length 5.3
  Top Layer w0.254: LED206.6 9.79,6.24 7.32,6.24 LED205.4
$1N2918: length 5.3
  Top Layer w0.254: 15.04,5.98 14.79,6.24 12.32,6.24 LED206.4
$1N2920: length 5.3
  Top Layer w0.254: 20.04,5.98 19.79,6.24 17.32,6.24 LED207.4
$1N2922: length 5.3
  Top Layer w0.254: LED208.4 22.32,6.24 24.79,6.24 25.04,5.98
$1N2924: length 5.3
  Top Layer w0.254: 30.04,5.98 29.79,6.24 27.32,6.24 LED209.4
$1N2926: length 5.3
  Top Layer w0.254: 35.04,5.98 34.79,6.24 32.32,6.24 LED210.4
$1N2928: length 5.3
  Top Layer w0.254: 40.04,5.98 39.79,6.24 37.32,6.24 LED211.4
$1N2930: length 5.3
  Top Layer w0.254: 45.04,5.98 44.79,6.24 42.32,6.24 LED212.4
$1N2932: length 5.3
  Top Layer w0.254: LED213.4 47.32,6.24 49.79,6.24 50.04,5.98
$1N2934: length 5.3
  Top Layer w0.254: 55.04,5.98 54.79,6.24 52.32,6.24 LED214.4
$1N2936: length 5.3
  Top Layer w0.254: LED215.4 57.32,6.24 59.79,6.24 60.04,5.98
$1N2938: length 5.3
  Top Layer w0.254: 54.19,4.02 54.45,3.77 56.92,3.77 LED216.1
$1N2940: length 5.3
  Top Layer w0.254: LED215.1 51.92,3.77 49.45,3.77 49.19,4.02
$1N2942: length 5.3
  Top Layer w0.254: LED214.1 46.92,3.77 44.45,3.77 44.19,4.02
$1N2944: length 5.3
  Top Layer w0.254: LED213.1 41.92,3.77 39.45,3.77 39.19,4.02
$1N2946: length 5.3
  Top Layer w0.254: LED212.1 36.92,3.77 34.45,3.77 34.19,4.02
$1N2948: length 5.3
  Top Layer w0.254: 29.19,4.02 29.45,3.77 31.92,3.77 LED211.1
$1N2950: length 5.3
  Top Layer w0.254: 24.19,4.02 24.45,3.77 26.92,3.77 LED210.1
$1N2952: length 5.3
  Top Layer w0.254: LED209.1 21.92,3.77 19.45,3.77 19.19,4.02
$1N2954: length 5.3
  Top Layer w0.254: LED208.1 16.92,3.77 14.45,3.77 14.19,4.02
$1N2956: length 5.3
  Top Layer w0.254: LED206.3 9.45,3.77 11.92,3.77 LED207.1
$1N2958: length 5.3
  Top Layer w0.254: LED206.1 6.92,3.77 4.45,3.77 4.19,4.02
$1N2960: length 61
  Top Layer w0.254: v1(61.06,5.34) 60.81,5.34 ; 60.81,5.34 60.81,6.35 60.3,6.86 6.93,6.86 LED205.5 ; 60.81,5.34 60.41,5.34 LED216.5
  Bottom Layer w0.254: C18.1 v1(61.06,5.34)
$1N79936: length 7.2
  Top Layer w0.254: LED180.4 60.54,19.37 59.36,18.19 58.6,18.19 55.81,20.98 55.04,20.98
$1N79939: length 7.2
  Top Layer w0.254: LED179.4 55.54,19.37 54.36,18.19 53.6,18.19 50.81,20.98 50.04,20.98
$1N79942: length 7.2
  Top Layer w0.254: LED178.4 50.54,19.37 49.36,18.19 48.6,18.19 45.81,20.98 45.04,20.98
$1N79945: length 7.2
  Top Layer w0.254: LED177.4 45.54,19.37 44.36,18.19 43.6,18.19 40.81,20.98 40.04,20.98
$1N79948: length 7.2
  Top Layer w0.254: 35.04,20.98 36.06,20.98 38.85,18.19 39.36,18.19 40.54,19.37 LED176.4
$1N79951: length 7.2
  Top Layer w0.254: LED175.4 35.54,19.37 34.36,18.19 33.6,18.19 30.81,20.98 30.04,20.98
$1N79954: length 7.2
  Top Layer w0.254: LED174.4 30.54,19.37 29.36,18.19 28.6,18.19 25.81,20.98 25.04,20.98
$1N79957: length 7.2
  Top Layer w0.254: 20.04,20.98 21.06,20.98 23.85,18.19 24.36,18.19 25.54,19.37 LED173.4
$1N79960: length 7.2
  Top Layer w0.254: 15.04,20.98 15.81,20.98 18.6,18.19 19.36,18.19 20.54,19.37 LED172.4
$1N79963: length 7.2
  Top Layer w0.254: LED171.4 15.54,19.37 14.36,18.19 13.6,18.19 10.81,20.98 LED170.6
$1N79966: length 7.2
  Top Layer w0.254: 5.04,20.98 5.81,20.98 8.6,18.19 9.36,18.19 10.54,19.37 LED170.4
$1N79969: length 7.3
  Top Layer w0.254: LED170.3 8.59,19.02 5.8,21.82 4.72,21.82 3.7,20.8 LED169.1
$1N79972: length 7.3
  Top Layer w0.254: LED170.1 8.7,20.8 9.72,21.82 10.8,21.82 13.59,19.02 14.19,19.02
$1N79975: length 7.3
  Top Layer w0.254: 19.19,19.02 18.59,19.02 15.8,21.82 14.72,21.82 13.7,20.8 LED171.1
$1N79978: length 7.3
  Top Layer w0.254: LED172.1 18.7,20.8 19.72,21.82 20.84,21.82 23.63,19.02 24.19,19.02
$1N79981: length 7.3
  Top Layer w0.254: 29.19,19.02 28.59,19.02 25.8,21.82 24.72,21.82 23.7,20.8 LED173.1
$1N79984: length 7.3
  Top Layer w0.254: 34.19,19.02 33.59,19.02 30.8,21.82 29.72,21.82 28.7,20.8 LED174.1
$1N79987: length 7.3
  Top Layer w0.254: LED175.1 33.7,20.8 34.72,21.82 35.84,21.82 38.63,19.02 39.19,19.02
$1N79990: length 7.3
  Top Layer w0.254: LED176.1 38.7,20.8 39.72,21.82 40.8,21.82 43.59,19.02 44.19,19.02
$1N79993: length 7.3
  Top Layer w0.254: LED177.1 43.7,20.8 44.72,21.82 45.8,21.82 48.59,19.02 49.19,19.02
$1N79996: length 7.3
  Top Layer w0.254: LED178.1 48.7,20.8 49.72,21.82 50.8,21.82 53.59,19.02 54.19,19.02
$1N79999: length 7.3
  Top Layer w0.254: LED179.1 53.7,20.8 54.72,21.82 55.64,21.82 58.43,19.02 59.19,19.02
$1N80018: length 5.3
  Top Layer w0.254: LED182.6 9.79,16.24 7.32,16.24 LED181.4
$1N80020: length 5.3
  Top Layer w0.254: 15.04,15.98 14.79,16.24 12.32,16.24 LED182.4
$1N80022: length 5.3
  Top Layer w0.254: 20.04,15.98 19.79,16.24 17.32,16.24 LED183.4
$1N80024: length 5.3
  Top Layer w0.254: LED184.4 22.32,16.24 24.79,16.24 25.04,15.98
$1N80026: length 5.3
  Top Layer w0.254: LED185.4 27.32,16.24 29.79,16.24 30.04,15.98
$1N80028: length 5.3
  Top Layer w0.254: 35.04,15.98 34.79,16.24 32.32,16.24 LED186.4
$1N80030: length 5.3
  Top Layer w0.254: LED187.4 37.32,16.24 39.79,16.24 40.04,15.98
$1N80032: length 5.3
  Top Layer w0.254: 45.04,15.98 44.79,16.24 42.32,16.24 LED188.4
$1N80034: length 5.3
  Top Layer w0.254: 50.04,15.98 49.79,16.24 47.32,16.24 LED189.4
$1N80036: length 5.3
  Top Layer w0.254: 55.04,15.98 54.79,16.24 52.32,16.24 LED190.4
$1N80038: length 5.3
  Top Layer w0.254: 60.04,15.98 59.79,16.24 57.32,16.24 LED191.4
$1N80040: length 5.3
  Top Layer w0.254: LED192.1 56.92,13.77 54.45,13.77 54.19,14.02
$1N80042: length 5.3
  Top Layer w0.254: LED191.1 51.92,13.77 49.45,13.77 49.19,14.02
$1N80044: length 5.3
  Top Layer w0.254: LED190.1 46.92,13.77 44.45,13.77 44.19,14.02
$1N80046: length 5.3
  Top Layer w0.254: LED189.1 41.92,13.77 39.45,13.77 39.19,14.02
$1N80048: length 5.3
  Top Layer w0.254: LED188.1 36.92,13.77 34.45,13.77 34.19,14.02
$1N80050: length 5.3
  Top Layer w0.254: 29.19,14.02 29.45,13.77 31.92,13.77 LED187.1
$1N80052: length 5.3
  Top Layer w0.254: 24.19,14.02 24.45,13.77 26.92,13.77 LED186.1
$1N80054: length 5.3
  Top Layer w0.254: 19.19,14.02 19.45,13.77 21.92,13.77 LED185.1
$1N80070: length 5.3
  Top Layer w0.254: 4.19,14.02 4.45,13.77 6.92,13.77 LED182.1
$1N80072: length 5.3
  Top Layer w0.254: LED183.1 11.92,13.77 9.45,13.77 LED182.3
$1N80074: length 5.3
  Top Layer w0.254: 14.19,14.02 14.45,13.77 16.92,13.77 LED184.1
$1N81180: length 7.2
  Top Layer w0.254: 55.04,30.98 55.81,30.98 58.6,28.19 59.36,28.19 60.54,29.37 LED156.4
$1N81183: length 7.2
  Top Layer w0.254: LED155.4 55.54,29.37 54.36,28.19 53.6,28.19 50.81,30.98 50.04,30.98
$1N81186: length 7.2
  Top Layer w0.254: 45.04,30.98 45.81,30.98 48.6,28.19 49.36,28.19 50.54,29.37 LED154.4
$1N81189: length 7.2
  Top Layer w0.254: LED153.4 45.54,29.37 44.36,28.19 43.6,28.19 40.81,30.98 40.04,30.98
$1N81192: length 7.2
  Top Layer w0.254: 35.04,30.98 36.06,30.98 38.85,28.19 39.36,28.19 40.54,29.37 LED152.4
$1N81195: length 7.2
  Top Layer w0.254: 30.04,30.98 30.81,30.98 33.6,28.19 34.36,28.19 35.54,29.37 LED151.4
$1N81198: length 7.2
  Top Layer w0.254: 25.04,30.98 25.81,30.98 28.6,28.19 29.36,28.19 30.54,29.37 LED150.4
$1N81201: length 7.2
  Top Layer w0.254: 20.04,30.98 21.06,30.98 23.85,28.19 24.36,28.19 25.54,29.37 LED149.4
$1N81204: length 7.2
  Top Layer w0.254: 15.04,30.98 15.81,30.98 18.6,28.19 19.36,28.19 20.54,29.37 LED148.4
$1N81207: length 7.2
  Top Layer w0.254: LED147.4 15.54,29.37 14.36,28.19 13.6,28.19 10.81,30.98 LED146.6
$1N81210: length 7.2
  Top Layer w0.254: LED146.4 10.54,29.37 9.36,28.19 8.6,28.19 5.81,30.98 5.04,30.98
$1N81213: length 7.3
  Top Layer w0.254: LED146.3 8.59,29.02 5.8,31.82 4.72,31.82 3.7,30.8 LED145.1
$1N81216: length 7.3
  Top Layer w0.254: 14.19,29.02 13.59,29.02 10.8,31.82 9.72,31.82 8.7,30.8 LED146.1
$1N81219: length 7.3
  Top Layer w0.254: 19.19,29.02 18.59,29.02 15.8,31.82 14.72,31.82 13.7,30.8 LED147.1
$1N81222: length 7.3
  Top Layer w0.254: 24.19,29.02 23.63,29.02 20.84,31.82 19.72,31.82 18.7,30.8 LED148.1
$1N81225: length 7.3
  Top Layer w0.254: LED149.1 23.7,30.8 24.72,31.82 25.8,31.82 28.59,29.02 29.19,29.02
$1N81228: length 7.3
  Top Layer w0.254: LED150.1 28.7,30.8 29.72,31.82 30.8,31.82 33.59,29.02 34.19,29.02
$1N81231: length 7.3
  Top Layer w0.254: 39.19,29.02 38.63,29.02 35.84,31.82 34.72,31.82 33.7,30.8 LED151.1
$1N81234: length 7.3
  Top Layer w0.254: 44.19,29.02 43.59,29.02 40.8,31.82 39.72,31.82 38.7,30.8 LED152.1
$1N81237: length 7.3
  Top Layer w0.254: 49.19,29.02 48.59,29.02 45.8,31.82 44.72,31.82 43.7,30.8 LED153.1
$1N81240: length 7.3
  Top Layer w0.254: 54.19,29.02 53.59,29.02 50.8,31.82 49.72,31.82 48.7,30.8 LED154.1
$1N81243: length 7.3
  Top Layer w0.254: LED155.1 53.7,30.8 54.72,31.82 55.64,31.82 58.43,29.02 59.19,29.02
$1N81262: length 5.3
  Top Layer w0.254: LED158.6 9.79,26.24 7.32,26.24 LED157.4
$1N81264: length 5.3
  Top Layer w0.254: LED158.4 12.32,26.24 14.79,26.24 15.04,25.98
$1N81266: length 5.3
  Top Layer w0.254: 20.04,25.98 19.79,26.24 17.32,26.24 LED159.4
$1N81268: length 5.3
  Top Layer w0.254: 25.04,25.98 24.79,26.24 22.32,26.24 LED160.4
$1N81270: length 5.3
  Top Layer w0.254: 30.04,25.98 29.79,26.24 27.32,26.24 LED161.4
$1N81272: length 5.3
  Top Layer w0.254: LED162.4 32.32,26.24 34.79,26.24 35.04,25.98
$1N81274: length 5.3
  Top Layer w0.254: LED163.4 37.32,26.24 39.79,26.24 40.04,25.98
$1N81276: length 5.3
  Top Layer w0.254: 45.04,25.98 44.79,26.24 42.32,26.24 LED164.4
$1N81278: length 5.3
  Top Layer w0.254: LED165.4 47.32,26.24 49.79,26.24 50.04,25.98
$1N81280: length 5.3
  Top Layer w0.254: 55.04,25.98 54.79,26.24 52.32,26.24 LED166.4
$1N81282: length 5.3
  Top Layer w0.254: LED167.4 57.32,26.24 59.79,26.24 60.04,25.98
$1N81284: length 5.3
  Top Layer w0.254: 54.19,24.02 54.45,23.77 56.92,23.77 LED168.1
$1N81286: length 5.3
  Top Layer w0.254: 49.19,24.02 49.45,23.77 51.92,23.77 LED167.1
$1N81288: length 5.3
  Top Layer w0.254: 44.19,24.02 44.45,23.77 46.92,23.77 LED166.1
$1N81290: length 5.3
  Top Layer w0.254: 39.19,24.02 39.45,23.77 41.92,23.77 LED165.1
$1N81292: length 5.3
  Top Layer w0.254: 34.19,24.02 34.45,23.77 36.92,23.77 LED164.1
$1N81294: length 5.3
  Top Layer w0.254: LED163.1 31.92,23.77 29.45,23.77 29.19,24.02
$1N81296: length 5.3
  Top Layer w0.254: LED162.1 26.92,23.77 24.45,23.77 24.19,24.02
$1N81298: length 5.3
  Top Layer w0.254: 19.19,24.02 19.45,23.77 21.92,23.77 LED161.1
$1N81314: length 5.3
  Top Layer w0.254: 4.19,24.02 4.45,23.77 6.92,23.77 LED158.1
$1N81316: length 5.3
  Top Layer w0.254: LED159.1 11.92,23.77 9.45,23.77 LED158.3
$1N81318: length 5.3
  Top Layer w0.254: LED160.1 16.92,23.77 14.45,23.77 14.19,24.02
$1N82424: length 7.2
  Top Layer w0.254: LED132.4 60.54,39.37 59.36,38.19 58.6,38.19 55.81,40.98 55.04,40.98
$1N82427: length 7.2
  Top Layer w0.254: 50.04,40.98 50.81,40.98 53.6,38.19 54.36,38.19 55.54,39.37 LED131.4
$1N82430: length 7.2
  Top Layer w0.254: 45.04,40.98 45.81,40.98 48.6,38.19 49.36,38.19 50.54,39.37 LED130.4
$1N82433: length 7.2
  Top Layer w0.254: LED129.4 45.54,39.37 44.36,38.19 43.6,38.19 40.81,40.98 40.04,40.98
$1N82436: length 7.2
  Top Layer w0.254: 35.04,40.98 35.81,40.98 38.6,38.19 39.36,38.19 40.54,39.37 LED128.4
$1N82439: length 7.2
  Top Layer w0.254: 30.04,40.98 30.81,40.98 33.6,38.19 34.36,38.19 35.54,39.37 LED127.4
$1N82442: length 7.2
  Top Layer w0.254: LED126.4 30.54,39.37 29.36,38.19 28.6,38.19 25.81,40.98 25.04,40.98
$1N82445: length 7.2
  Top Layer w0.254: LED125.4 25.54,39.37 24.36,38.19 23.6,38.19 20.81,40.98 20.04,40.98
$1N82448: length 7.2
  Top Layer w0.254: LED124.4 20.54,39.37 19.36,38.19 18.6,38.19 15.81,40.98 15.04,40.98
$1N82451: length 7.2
  Top Layer w0.254: LED123.4 15.54,39.37 14.36,38.19 13.6,38.19 10.81,40.98 LED122.6
$1N82454: length 7.2
  Top Layer w0.254: LED122.4 10.54,39.37 9.36,38.19 8.6,38.19 5.81,40.98 5.04,40.98
$1N82457: length 7.3
  Top Layer w0.254: LED121.1 3.7,40.8 4.72,41.82 5.64,41.82 8.43,39.02 LED122.3
$1N82460: length 7.3
  Top Layer w0.254: 14.19,39.02 13.43,39.02 10.64,41.82 9.72,41.82 8.7,40.8 LED122.1
$1N82463: length 7.3
  Top Layer w0.254: LED123.1 13.7,40.8 14.72,41.82 15.64,41.82 18.43,39.02 19.19,39.02
$1N82466: length 7.3
  Top Layer w0.254: 24.19,39.02 24.1,39.12 23.43,39.12 20.73,41.82 19.72,41.82 18.7,40.8 LED124.1
$1N82469: length 7.3
  Top Layer w0.254: LED125.1 23.7,40.8 24.72,41.82 25.64,41.82 28.43,39.02 29.19,39.02
$1N82472: length 7.3
  Top Layer w0.254: 34.19,39.02 33.43,39.02 30.64,41.82 29.72,41.82 28.7,40.8 LED126.1
$1N82475: length 7.3
  Top Layer w0.254: 39.19,39.02 39.1,39.12 38.43,39.12 35.73,41.82 34.72,41.82 33.7,40.8 LED127.1
$1N82478: length 7.3
  Top Layer w0.254: LED128.1 38.7,40.8 39.72,41.82 40.64,41.82 43.43,39.02 44.19,39.02
$1N82481: length 7.3
  Top Layer w0.254: LED129.1 43.7,40.8 44.72,41.82 45.64,41.82 48.43,39.02 49.19,39.02
$1N82484: length 7.3
  Top Layer w0.254: 54.19,39.02 53.43,39.02 50.64,41.82 49.72,41.82 48.7,40.8 LED130.1
$1N82487: length 7.3
  Top Layer w0.254: 59.19,39.02 58.43,39.02 55.64,41.82 54.72,41.82 53.7,40.8 LED131.1
$1N82506: length 5.3
  Top Layer w0.254: LED133.4 7.32,36.24 9.79,36.24 LED134.6
$1N82508: length 5.3
  Top Layer w0.254: LED134.4 12.32,36.24 14.79,36.24 15.04,35.98
$1N82510: length 5.3
  Top Layer w0.254: LED135.4 17.32,36.24 19.79,36.24 20.04,35.98
$1N82512: length 5.3
  Top Layer w0.254: 25.04,35.98 24.79,36.24 22.32,36.24 LED136.4
$1N82514: length 5.3
  Top Layer w0.254: LED137.4 27.32,36.24 29.79,36.24 30.04,35.98
$1N82516: length 5.3
  Top Layer w0.254: LED138.4 32.32,36.24 34.79,36.24 35.04,35.98
$1N82518: length 5.3
  Top Layer w0.254: 40.04,35.98 39.79,36.24 37.32,36.24 LED139.4
$1N82520: length 5.3
  Top Layer w0.254: 45.04,35.98 44.79,36.24 42.32,36.24 LED140.4
$1N82522: length 5.3
  Top Layer w0.254: LED141.4 47.32,36.24 49.79,36.24 50.04,35.98
$1N82524: length 5.3
  Top Layer w0.254: LED142.4 52.32,36.24 54.79,36.24 55.04,35.98
$1N82526: length 5.3
  Top Layer w0.254: LED143.4 57.32,36.24 59.79,36.24 60.04,35.98
$1N82528: length 5.3
  Top Layer w0.254: LED144.1 56.92,33.77 54.45,33.77 54.19,34.02
$1N82530: length 5.3
  Top Layer w0.254: LED143.1 51.92,33.77 49.45,33.77 49.19,34.02
$1N82532: length 5.3
  Top Layer w0.254: 44.19,34.02 44.45,33.77 46.92,33.77 LED142.1
$1N82534: length 5.3
  Top Layer w0.254: 39.19,34.02 39.45,33.77 41.92,33.77 LED141.1
$1N82536: length 5.3
  Top Layer w0.254: LED140.1 36.92,33.77 34.45,33.77 34.19,34.02
$1N82538: length 5.3
  Top Layer w0.254: 29.19,34.02 29.45,33.77 31.92,33.77 LED139.1
$1N82540: length 5.3
  Top Layer w0.254: 24.19,34.02 24.45,33.77 26.92,33.77 LED138.1
$1N82542: length 5.3
  Top Layer w0.254: 19.19,34.02 19.45,33.77 21.92,33.77 LED137.1
$1N82558: length 5.3
  Top Layer w0.254: 4.19,34.02 4.45,33.77 6.92,33.77 LED134.1
$1N82560: length 5.3
  Top Layer w0.254: LED134.3 9.45,33.77 11.92,33.77 LED135.1
$1N82562: length 5.3
  Top Layer w0.254: 14.19,34.02 14.45,33.77 16.92,33.77 LED136.1
$1N83668: length 7.2
  Top Layer w0.254: 55.04,50.98 55.81,50.98 58.6,48.19 59.36,48.19 60.54,49.37 LED108.4
$1N83671: length 7.2
  Top Layer w0.254: LED107.4 55.54,49.37 54.36,48.19 53.6,48.19 50.81,50.98 50.04,50.98
$1N83674: length 7.2
  Top Layer w0.254: LED106.4 50.54,49.37 49.36,48.19 48.6,48.19 45.81,50.98 45.04,50.98
$1N83677: length 7.2
  Top Layer w0.254: LED105.4 45.38,49.3 45.38,49.21 44.36,48.19 43.6,48.19 40.81,50.98 40.04,50.98
$1N83680: length 7.2
  Top Layer w0.254: 35.04,50.98 36.06,50.98 38.85,48.19 39.36,48.19 40.54,49.37 LED104.4
$1N83683: length 7.2
  Top Layer w0.254: LED103.4 35.54,49.37 34.36,48.19 33.6,48.19 30.81,50.98 30.04,50.98
$1N83686: length 7.2
  Top Layer w0.254: 25.04,50.98 25.81,50.98 28.6,48.19 29.36,48.19 30.38,49.21 30.38,49.3 LED102.4
$1N83689: length 7.2
  Top Layer w0.254: LED101.4 25.54,49.37 24.36,48.19 23.85,48.19 21.06,50.98 20.04,50.98
$1N83692: length 7.2
  Top Layer w0.254: 15.04,50.98 15.81,50.98 18.6,48.19 19.36,48.19 20.54,49.37 LED100.4
$1N83695: length 7.2
  Top Layer w0.254: LED98.6 10.81,50.98 13.6,48.19 14.36,48.19 15.54,49.37 LED99.4
$1N83698: length 7.2
  Top Layer w0.254: LED98.4 10.54,49.37 9.36,48.19 8.6,48.19 5.81,50.98 5.04,50.98
$1N83701: length 7.3
  Top Layer w0.254: LED97.1 3.7,50.8 4.72,51.82 5.8,51.82 8.59,49.02 LED98.3
$1N83704: length 7.3
  Top Layer w0.254: 14.19,49.02 13.59,49.02 10.8,51.82 9.72,51.82 8.7,50.8 LED98.1
$1N83707: length 7.3
  Top Layer w0.254: 19.19,49.02 18.59,49.02 15.8,51.82 14.72,51.82 13.7,50.8 LED99.1
$1N83710: length 7.3
  Top Layer w0.254: LED100.1 18.7,50.8 19.72,51.82 20.84,51.82 23.63,49.02 24.19,49.02
$1N83713: length 7.3
  Top Layer w0.254: 29.19,49.02 28.59,49.02 25.8,51.82 24.72,51.82 23.7,50.8 LED101.1
$1N83716: length 7.3
  Top Layer w0.254: 34.19,49.02 33.59,49.02 30.8,51.82 29.72,51.82 28.7,50.8 LED102.1
$1N83719: length 7.3
  Top Layer w0.254: 39.19,49.02 38.63,49.02 35.84,51.82 34.72,51.82 33.7,50.8 LED103.1
$1N83722: length 7.3
  Top Layer w0.254: LED104.1 38.7,50.8 39.72,51.82 40.8,51.82 43.59,49.02 44.19,49.02
$1N83725: length 7.3
  Top Layer w0.254: 49.19,49.02 48.59,49.02 45.8,51.82 44.72,51.82 43.7,50.8 LED105.1
$1N83728: length 7.3
  Top Layer w0.254: LED106.1 48.7,50.8 49.72,51.82 50.8,51.82 53.59,49.02 54.19,49.02
$1N83731: length 7.3
  Top Layer w0.254: LED107.1 53.7,50.8 54.72,51.82 55.64,51.82 58.43,49.02 59.19,49.02
$1N83750: length 5.3
  Top Layer w0.254: LED109.4 7.32,46.24 9.79,46.24 LED110.6
$1N83752: length 5.3
  Top Layer w0.254: 15.04,45.98 14.79,46.24 12.32,46.24 LED110.4
$1N83754: length 5.3
  Top Layer w0.254: LED111.4 17.32,46.24 19.79,46.24 20.04,45.98
$1N83756: length 5.3
  Top Layer w0.254: LED112.4 22.32,46.24 24.79,46.24 25.04,45.98
$1N83758: length 5.3
  Top Layer w0.254: LED113.4 27.32,46.24 29.79,46.24 30.04,45.98
$1N83760: length 5.3
  Top Layer w0.254: LED114.4 32.32,46.24 34.79,46.24 35.04,45.98
$1N83762: length 5.3
  Top Layer w0.254: LED115.4 37.32,46.24 39.79,46.24 40.04,45.98
$1N83764: length 5.3
  Top Layer w0.254: LED116.4 42.32,46.24 44.79,46.24 45.04,45.98
$1N83766: length 5.3
  Top Layer w0.254: 50.04,45.98 49.79,46.24 47.32,46.24 LED117.4
$1N83768: length 5.3
  Top Layer w0.254: LED118.4 52.32,46.24 54.79,46.24 55.04,45.98
$1N83770: length 5.3
  Top Layer w0.254: 60.04,45.98 59.79,46.24 57.32,46.24 LED119.4
$1N83772: length 5.3
  Top Layer w0.254: 54.19,44.02 54.45,43.77 56.92,43.77 LED120.1
$1N83774: length 5.3
  Top Layer w0.254: LED119.1 51.92,43.77 49.45,43.77 49.19,44.02
